# EAGLE design pure_energy (EAGLE 9.5.2)
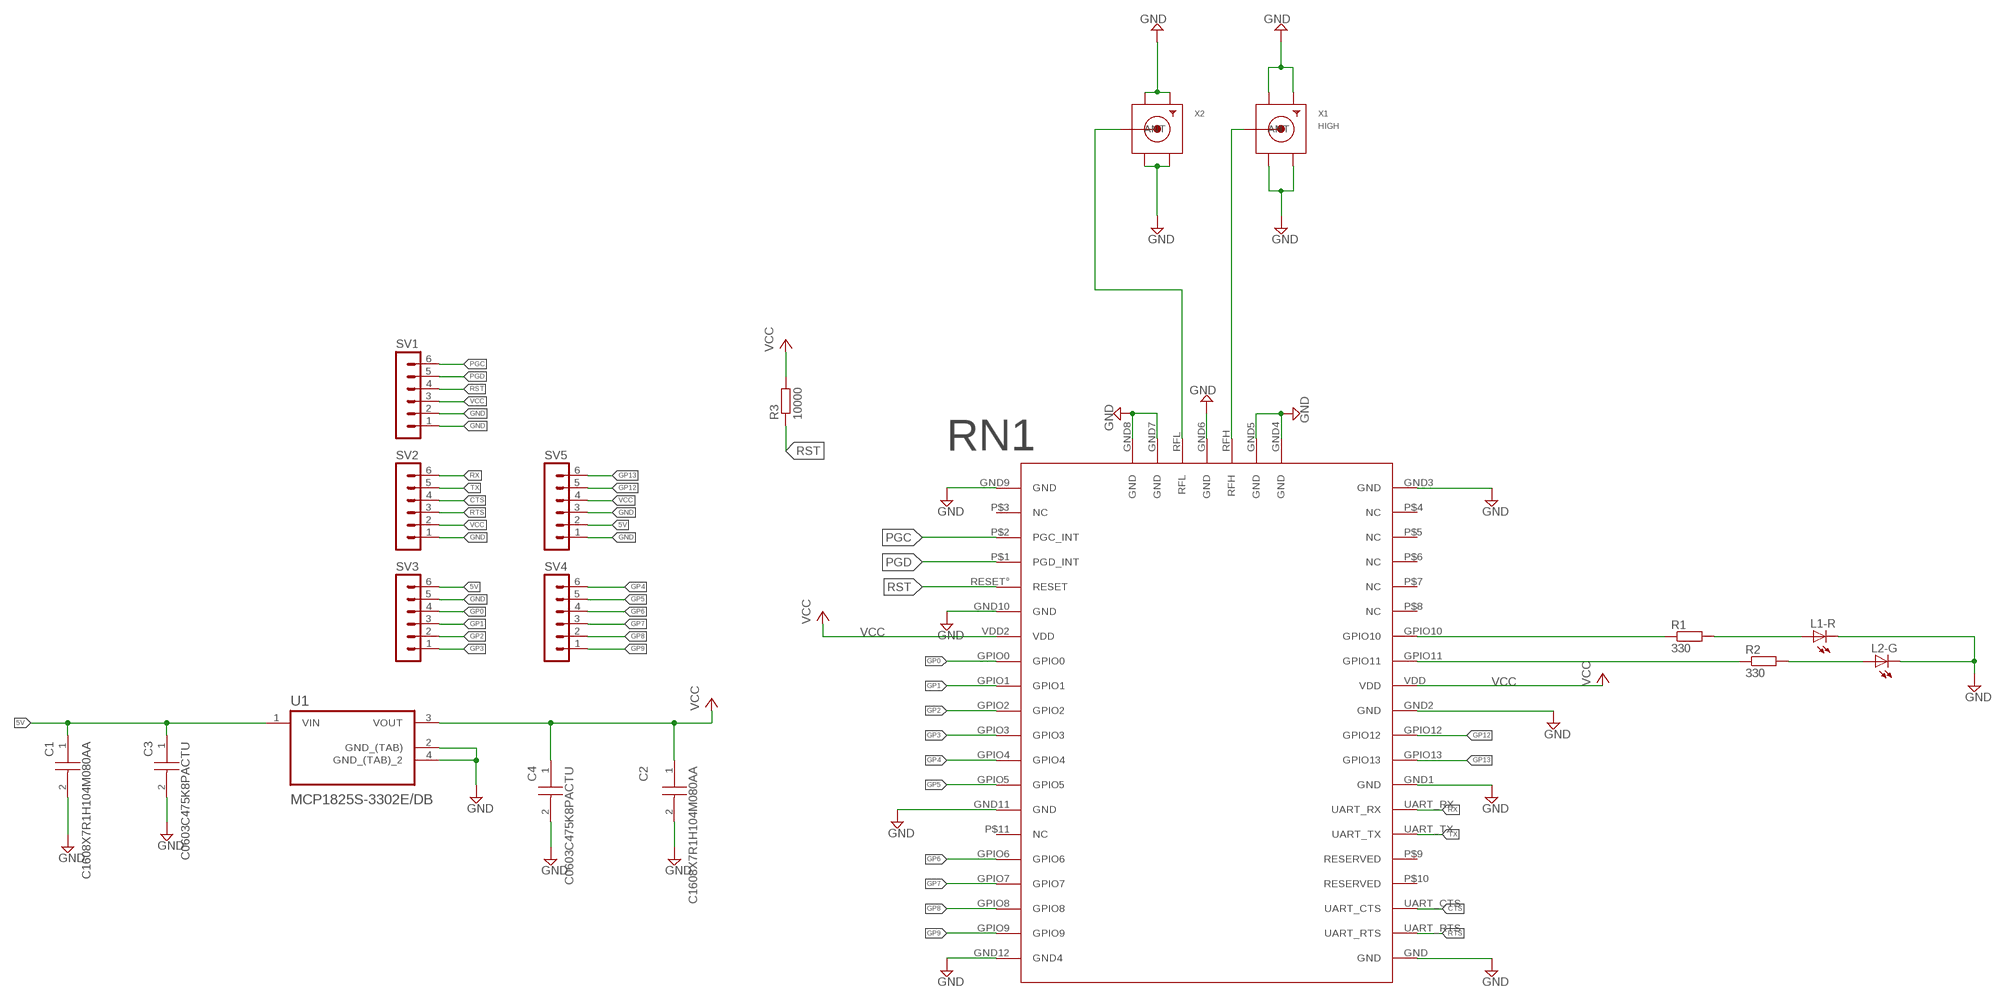
[diagram p0: schematic, sheet 1]

## Parts
C1  C1608X7R1H104M080AA  [CAPC1608X80N]
C2  C1608X7R1H104M080AA  [CAPC1608X80N]
C3  C0603C475K8PACTU  [CAPC1608X85N]
C4  C0603C475K8PACTU  [CAPC1608X85N]
L1-R  LEDCHIP-LED0603  [CHIP-LED0603]
L2-G  LEDCHIP-LED0603  [CHIP-LED0603]
R1  330  R-EU_R0603  [R0603]
R2  330  R-EU_R0603  [R0603]
R3  10000  R-EU_R0603  [R0603]
RN1  NEW_RN2483  [NEW_RN2483]
SV1  MA06-1  [MA06-1]
SV2  MA06-1  [MA06-1]
SV3  MA06-1  [MA06-1]
SV4  MA06-1  [MA06-1]
SV5  MA06-1  [MA06-1]
U1  MCP1825S-3302E/DB  [SOT230P700X180-4N]
X1  HIGH  SMACONNECTOR_EDGE  [SMA_EDGELAUNCH]
X2  SMACONNECTOR_EDGE  [SMA_EDGELAUNCH]

## Nets
5V: C1.1 C3.1(C1) SV3.6 SV5.2 U1.1(VIN)
CTS: RN1.UART_CTS SV2.4
GND: C1.2 C2.2 C3.2(C2) C4.2(C2) L1-R.C L2-G.C RN1.GND RN1.GND1(GND) RN1.GND2(GND) RN1.GND3(GND) RN1.GND4(GND) RN1.GND5(GND) RN1.GND6(GND) RN1.GND7(GND) RN1.GND8(GND) RN1.GND9(GND) RN1.GND10(GND) RN1.GND11(GND) RN1.GND12(GND4) SV1.1 SV1.2 SV2.1 SV3.5 SV5.1 SV5.3 U1.2(GND_(TAB)) U1.4(GND_(TAB)_2) X1.GND@1(GND4) X1.GND@2(GND3) X1.GND@3(GND2) X1.GND@4(GND1) X2.GND@1(GND4) X2.GND@2(GND3) X2.GND@3(GND2) X2.GND@4(GND1)
GP0: RN1.GPIO0 SV3.4
GP1: RN1.GPIO1 SV3.3
GP2: RN1.GPIO2 SV3.2
GP3: RN1.GPIO3 SV3.1
GP4: RN1.GPIO4 SV4.6
GP5: RN1.GPIO5 SV4.5
GP6: RN1.GPIO6 SV4.4
GP7: RN1.GPIO7 SV4.3
GP8: RN1.GPIO8 SV4.2
GP9: RN1.GPIO9 SV4.1
GP12: RN1.GPIO12 SV5.5
GP13: RN1.GPIO13 SV5.6
N$2: RN1.RFL X2.P(ANT)
N$10: R1.1 RN1.GPIO10
N$11: R2.1 RN1.GPIO11
N$12: L1-R.A R1.2
N$13: L2-G.A R2.2
N$15: RN1.RFH X1.P(ANT)
PGC: RN1.P$2(PGC_INT) SV1.6
PGD: RN1.P$1(PGD_INT) SV1.5
RST: R3.1 RN1.RESET°(RESET) SV1.4
RTS: RN1.UART_RTS SV2.3
RX: RN1.UART_RX SV2.6
TX: RN1.UART_TX SV2.5
VCC: C2.1 C4.1(C1) R3.2 RN1.VDD RN1.VDD2(VDD) SV1.3 SV2.2 SV5.4 U1.3(VOUT)
Unconnected: RN1.P$3(NC) RN1.P$4(NC) RN1.P$5(NC) RN1.P$6(NC) RN1.P$7(NC) RN1.P$8(NC) RN1.P$9(RESERVED) RN1.P$10(RESERVED) RN1.P$11(NC)

## Library data of the parts
C1 C2 = C1608X7R1H104M080AA:C1608X7R1H104M080AA: TDK 0603 C 100nF Ceramic Multilayer Capacitor, 50 V dc, +125C, X7R Dielectric, +/-20% Source: Datasheet <https://product.tdk.com/info/en/catalog/datasheets/mlcc_commercial_midvoltage_en.pdf>; ARROW_PART_NUMBER: C1608X7R1H104M080AA; ARROW_PRICE-STOCK: https://www.arrow.com/en/products/c1608x7r1h104m080aa/tdk; DESCRIPTION: TDK 0603 C 100nF Ceramic Multilayer Capacitor, 50 V dc, +125C, X7R Dielectric, +/-20%; HEIGHT: 0.8mm; MANUFACTURER_NAME: TDK; MANUFACTURER_PART_NUMBER: C1608X7R1H104M080AA; MOUSER_PART_NUMBER: 810-C1608X7R1H104M; MOUSER_PRICE-STOCK: https://www.mouser.co.uk/ProductDetail/TDK/C1608X7R1H104M080AA?qs=dfay7wIA1uEL2BE%2FFUaTdg%3D%3D
C3 C4 = C0603C475K8PACTU:C0603C475K8PACTU: CAPACITOR, 0603 4.7uF +/-10% 10V Source: Datasheet <http://componentsearchengine.com/Datasheets/1/C0603C475K8PACTU.pdf>; ARROW_PART_NUMBER: C0603C475K8PACTU; ARROW_PRICE-STOCK: https://www.arrow.com/en/products/c0603c475k8pactu/kemet-corporation; DESCRIPTION: CAPACITOR, 0603 4.7uF +/-10% 10V; HEIGHT: mm; MANUFACTURER_NAME: Kemet; MANUFACTURER_PART_NUMBER: C0603C475K8PACTU; MOUSER_PART_NUMBER: 80-C0603C475K8P; MOUSER_PRICE-STOCK: https://www.mouser.co.uk/ProductDetail/KEMET/C0603C475K8PACTU?qs=K%2Fj%2Fqf%252B0fqK6lAUxhlPmKA%3D%3D
L1-R L2-G = adafruit:LED: LED OSRAM: - CHIPLED LG R971, LG N971, LY N971, LG Q971, LY Q971, LO R971, LY R971 LH N974, LH R974 LS Q976, LO Q976, LY Q976 LO Q996 - Hyper CHIPLED LW Q18S LB Q993, LB Q99A, LB R99A - SideLED LS A670, LO A670, LY A670, LG A670, LP A670 LB A673, LV A673, LT A673, LW A673 LH A674 LY A675 LS A676, LA A676, LO A676, LY A676, LW A676 LS A679, LY A679, LG A679 - Hyper Micro SIDELED® LS Y876, LA Y876, LO Y876, LY Y876 LT Y87S - SmartLED LW L88C, LW L88S LB L89C, LB L89S, LG L890 LS L89K, LO L89K, LY L89K LS L896, LA L896, LO L896, LY L896 - TOPLED LS T670, LO T670, LY T670, LG T670, LP T670 LSG T670, LSP T670, LSY T670, LOP T670, LYG T670 LG T671, LOG T671, LSG T671 LB T673, LV T673, LT T673, LW T673 LH T674 LS T676, LA T676, LO T676, LY T676, LB T676, LH T676, LSB T676, LW T676 LB T67C, LV T67C, LT T67C, LS T67K, LO T67K, LY T67K, LW E67C LS E67B, LA E67B, LO E67B, LY E67B, LB E67C, LV E67C, LT E67C LW T67C LS T679, LY T679, LG T679 LS T770, LO T770, LY T770, LG T770, LP T770 LB T773, LV T773, LT T773, LW T773 LH T774 LS E675, LA E675, LY E675, LS T675 LS T776, LA T776, LO T776, LY T776, LB T776 LHGB T686 LT T68C, LB T68C - Hyper Mini TOPLED® LB M676 - Mini TOPLED Santana® LG M470 LS M47K, LO M47K, LY M47K Source: http://www.osram.convergy.de/
R1-R3 = rcl:R-EU_: RESISTOR, European symbol; SPICEPREFIX: R
RN1 = tobias:NEW_RN2483
SV1-SV5 = con-lstb:MA06-1: PIN HEADER; OC_FARNELL: unknown; OC_NEWARK: unknown
U1 = MCP1825S-3302E_DB:MCP1825S-3302E/DB; AVAILABILITY: Unavailable; DESCRIPTION: Linear Voltage Regulator IC 1 Output 500mA SOT-223-3; MF: Microchip; MP: MCP1825S-3302E/DB; PACKAGE: SOT-223 Microchip; PRICE: None
X1 X2 = adafruit:SMACONNECTOR: SMA Connector 90° DIP SMA Connector, 50 Ohm (4UConnector: 07259)

## Net classes
0 default: width 0.305 mm, drill 0.254 mm, clearance 0.254 mm

## Board
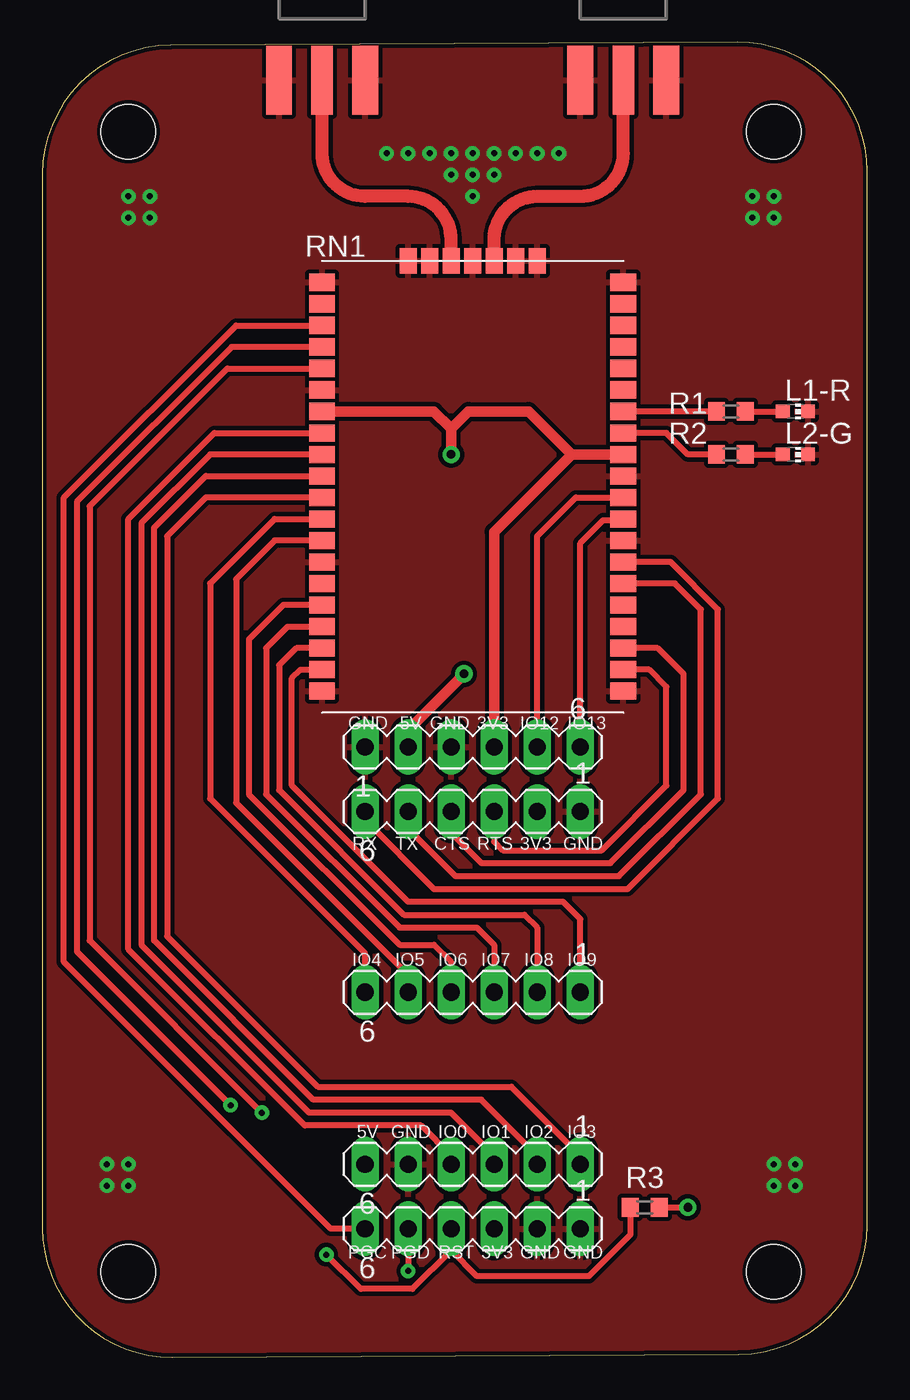
[diagram p1: board, top side]
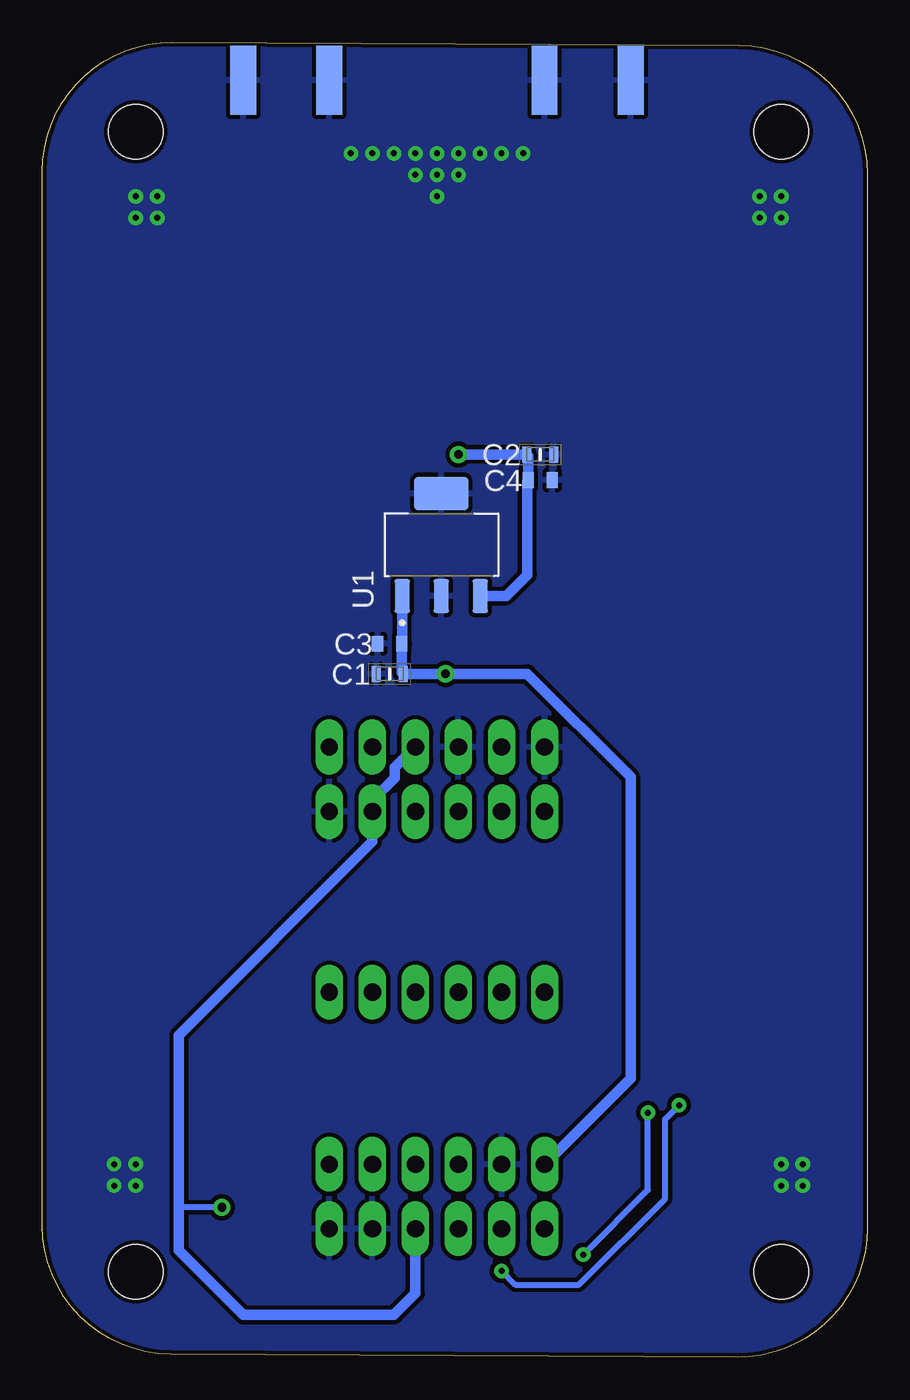
[diagram p2: board, bottom side, seen from below]

Size 48.69 x 77.63 mm. Coordinates in mm from the lower left corner, seen from the top.
Outline: 0,69.84 0,7.62 arc90 7.66,0 41.11,0.17 arc90 48.69,7.79 48.69,70.01 arc90 41.03,77.63 7.58,77.46 arc90 0,69.84
Copper layers (1*16): Top 0.035mm / dielectric 1.5mm / Bottom 0.035mm
Design rules "SparkFun": minimum track width 8mil, minimum drill 20mil, track to track 8mil, track to pad 8mil, pad to pad 8mil, via to via 8mil, smd to smd 8mil, copper to edge 10mil, drill to drill 8mil, minimum pad ring 12mil, minimum via ring 10mil, stop-mask expansion 4mil, vias tented up to drill 25mil, thermal gap 10mil
Holes 3.2 mm at 43.18,5.04 5.08,5.04 5.08,72.35 43.18,72.35

### Footprints (pad centres in the part's own frame; a part is rotated, then mirrored left to right if it is on the bottom)
CAPC1608X80N = smd 0.54 x 0.94: 1 -0.8,0; 2 0.8,0
CAPC1608X85N = smd 0.66 x 0.94: 1 -0.711,0; 2 0.711,0
CHIP-LED0603 = smd 0.8 x 0.8: A 0,-0.75; C 0,0.75
R0603 = smd 1 x 1.1: 1 -0.85,0; 2 0.85,0
NEW_RN2483 = smd 1.524 x 1.016: GND 17.78,1.27; GND1 17.78,10.16; GND2 17.78,13.97; GND3 17.78,25.4; GND9 0,25.4; GND10 0,19.05; GND11 0,8.89; GND12 0,1.27; GPIO0 0,16.51; GPIO1 0,15.24; GPIO2 0,13.97; GPIO3 0,12.7; GPIO4 0,11.43; GPIO5 0,10.16; GPIO6 0,6.35; GPIO7 0,5.08; GPIO8 0,3.81; GPIO9 0,2.54; GPIO10 17.78,17.78; GPIO11 17.78,16.51; GPIO12 17.78,12.7; GPIO13 17.78,11.43; P$1 0,21.59; P$2 0,22.86; P$3 0,24.13; P$4 17.78,24.13; P$5 17.78,22.86; P$6 17.78,21.59; P$7 17.78,20.32; P$8 17.78,19.05; P$9 17.78,6.35; P$10 17.78,5.08; P$11 0,7.62; RESET° 0,20.32; UART_CTS 17.78,3.81; UART_RTS 17.78,2.54; UART_RX 17.78,8.89; UART_TX 17.78,7.62; VDD 17.78,15.24; VDD2 0,17.78 | smd 1.016 x 1.524: GND4 12.7,26.67; GND5 11.43,26.67; GND6 8.89,26.67; GND7 6.35,26.67; GND8 5.08,26.67; RFH 10.16,26.67; RFL 7.62,26.67
MA06-1 = drill 1.016 long: 1 -6.35,0; 2 -3.81,0; 3 -1.27,0; 4 1.27,0; 5 3.81,0; 6 6.35,0
SOT230P700X180-4N = smd 1.97 x 0.89: 1 -3.025,2.3; 2 -3.025,0; 3 -3.025,-2.3 | smd 1.97 x 3.19: 4 3.025,0
SMA_EDGELAUNCH = smd 4.064 x 1.524: GND@1 2.032,-2.54; GND@2 2.032,2.54 | smd 4.064 x 1.524 bottom: GND@3 2.032,2.54; GND@4 2.032,-2.54 | smd 4.064 x 1.27: P 2.032,0

### Placement (x,y rotation side)
C1  28.19,40.35 180 bottom
C2  19.3,53.3 0 bottom
C3  28.19,42.12 180 bottom
C4  19.3,51.78 0 bottom
L1-R  44.45,55.84 270 top
L2-G  44.45,53.3 270 top
R1  40.64,55.84 0 top
R2  40.64,53.3 0 top
R3  35.56,8.85 0 top
RN1  16.51,38.06 0 top
SV1  25.4,7.58 180 top
SV2  25.4,32.22 180 top
SV3  25.4,11.39 180 top
SV4  25.4,21.55 180 top
SV5  25.4,36.03 0 top
U1  25.15,47.97 90 bottom
X1  34.29,77.43 270 top
X2  16.51,77.43 270 top

### Tracks (layer width: path | path; a pad name or v marks a point on that pad's centre or on a via)
5V  (via drill 0.51)
  Top 0.61: SV5.2 21.59,37.04 v24.89,40.35
  Bottom 0.61: U1.1 27.45,42.16 C3.1 27.48,40.44 C1.1 v24.89,40.35 20.07,40.35 13.97,34.25 13.97,16.47 SV3.6
CTS
  Top 0.356: SV2.4 24.13,30.95 25.91,29.17 33.53,29.17 37.85,33.49 37.85,40.35 36.32,41.87 RN1.UART_CTS
GND  (via drill 0.35)
  other vias: 43.18,68.54 43.18,67.27 5.08,68.54 41.91,68.54 41.91,67.27 6.35,68.54 5.08,67.27 6.35,67.27 30.48,71.08 29.21,71.08 27.94,71.08 26.67,71.08 25.4,71.08 24.13,71.08 22.86,71.08 21.59,71.08 20.32,71.08 25.4,69.81 26.67,69.81 24.13,69.81 25.4,68.54 43.18,10.12 44.45,10.12 44.45,11.39 43.18,11.39 5.08,10.12 5.08,11.39 3.81,11.39 3.81,10.12
  pour Top: -3.81,78.7 52.07,78.7 52.07,-3.85 -3.81,-3.85
  pour Bottom: -5.08,79.97 53.34,79.97 53.34,-5.12 -5.08,-5.12
GP0
  Top 0.356: SV3.4 24.13,11.9 22.35,13.68 15.49,13.68 5.08,24.09 5.08,49.49 10.16,54.57 RN1.GPIO0
GP1
  Top 0.356: RN1.GPIO1 9.91,53.3 5.84,49.24 5.84,24.34 15.75,14.44 24.13,14.44 26.67,11.9 SV3.3
GP2
  Top 0.356: SV3.2 29.21,11.9 25.91,15.2 16,15.2 6.6,24.6 6.6,48.98 9.65,52.03 RN1.GPIO2
GP3
  Top 0.356: RN1.GPIO3 9.65,50.76 7.37,48.47 7.37,24.85 16.26,15.96 27.69,15.96 31.75,11.9 SV3.1
GP4
  Top 0.356: SV4.6 19.05,23.84 9.91,32.98 9.91,45.68 13.72,49.49 RN1.GPIO4
GP5
  Top 0.356: RN1.GPIO5 13.72,48.22 11.43,45.93 11.43,32.73 21.59,22.57 SV4.5
GP6
  Top 0.356: RN1.GPIO6 14.22,44.41 12.19,42.38 12.19,33.23 21.08,24.34 23.11,24.34 24.13,23.33 SV4.4
GP7
  Top 0.356: RN1.GPIO7 14.48,43.14 13.21,41.87 13.21,33.23 21.08,25.36 25.65,25.36 26.67,24.34 SV4.3
GP8
  Top 0.356: RN1.GPIO8 14.99,41.87 13.97,40.85 13.97,33.49 21.34,26.12 28.45,26.12 29.21,25.36 SV4.2
GP9
  Top 0.356: RN1.GPIO9 15.24,40.6 14.73,40.09 14.73,33.74 21.59,26.88 30.73,26.88 31.75,25.87 SV4.1
GP12
  Top 0.356: SV5.5 29.21,48.47 31.5,50.76 RN1.GPIO12
GP13
  Top 0.356: RN1.GPIO13 34.21,49.41 33.09,49.41 31.75,48.07 SV5.6
N$2
  Top 0.762: RN1.RFL 24.13,66 arc90 21.59,68.54 19.05,68.54 arc-90 16.51,71.08 X2.P
N$10
  Top 0.356: R1.1 RN1.GPIO10
N$11
  Top 0.356: R2.1 38.1,53.3 36.83,54.57 RN1.GPIO11
N$12
  Top 0.356: R1.2 L1-R.A
N$13
  Top 0.356: R2.2 L2-G.A
N$15
  Top 0.762: RN1.RFH 26.67,66 arc-90 29.21,68.54 31.75,68.54 arc90 34.29,71.08 X1.P
PGC
  Top 0.356: RN1.P$2 11.43,60.92 1.27,50.76 1.27,23.33 17.02,7.58 SV1.6
PGD  (via drill 0.36)
  Top 0.356: RN1.P$1 11.18,59.65 2.03,50.51 2.03,23.96 v11.11,14.88 | SV1.5 v21.59,5.09
  Bottom 0.356: v21.59,5.09 20.78,4.28 17.02,4.28 11.94,9.36 11.94,14.05 v11.11,14.88
RST  (via drill 0.36)
  Top 0.356: RN1.RESET° 10.92,58.38 2.79,50.25 2.79,24.6 v12.95,14.44 | R3.1 34.71,7.24 32.26,4.79 25.65,4.79 24.13,6.31 | SV1.4 24.13,6.31 | 24.13,6.31 21.84,4.02 18.8,4.02 v16.76,6.06
  Bottom 0.356: v16.76,6.06 12.95,9.87 v12.95,14.44
RTS
  Top 0.356: SV2.3 26.67,30.44 27.18,29.93 33.02,29.93 36.83,33.74 36.83,39.58 35.81,40.6 RN1.UART_RTS
RX
  Top 0.356: SV2.6 19.05,31.71 23.11,27.65 34.54,27.65 39.88,32.98 39.88,44.16 37.08,46.95 RN1.UART_RX
TX
  Top 0.356: SV2.5 21.59,31.2 24.38,28.41 34.04,28.41 38.86,33.23 38.86,44.16 37.34,45.68 RN1.UART_TX
VCC  (via drill 0.51)
  Top 0.356: R3.2 v38.1,8.85
  Top 0.61: RN1.VDD2 23.11,55.84 24.09,54.86 | 24.09,54.86 24.17,54.86 25.15,55.84 28.7,55.84 31.24,53.3 | RN1.VDD 31.24,53.3 | 31.24,53.3 26.67,48.73 SV5.4 | v24.13,53.3 24.13,54.82 24.09,54.86
  Bottom 0.356: v38.1,8.85 40.64,8.85
  Bottom 0.61: U1.3 21.31,44.94 20.07,46.19 20.07,51.73 C4.1 20.02,53.21 C2.1 v24.13,53.3 | SV5.4 27.89,34.81 27.89,34.21 29.21,32.89 SV2.2 29.21,30.44 40.64,19.01 40.64,8.85 40.64,6.31 36.83,2.5 27.94,2.5 26.67,3.77 SV1.3

### Text on the board
tPlace: 5V | 3V3 | IO12 | IO13 | RX | TX | CTS | RTS | 3V3
tNames: GND | GND | GND | IO4 | IO5 | IO6 | IO7 | IO8 | IO9 | 5V | GND | IO0 | IO1 | IO2 | IO3 | PGC | PGD | RST | 3V3 | GND | GND